# EAGLE design sub_module (EAGLE 7.5.0)
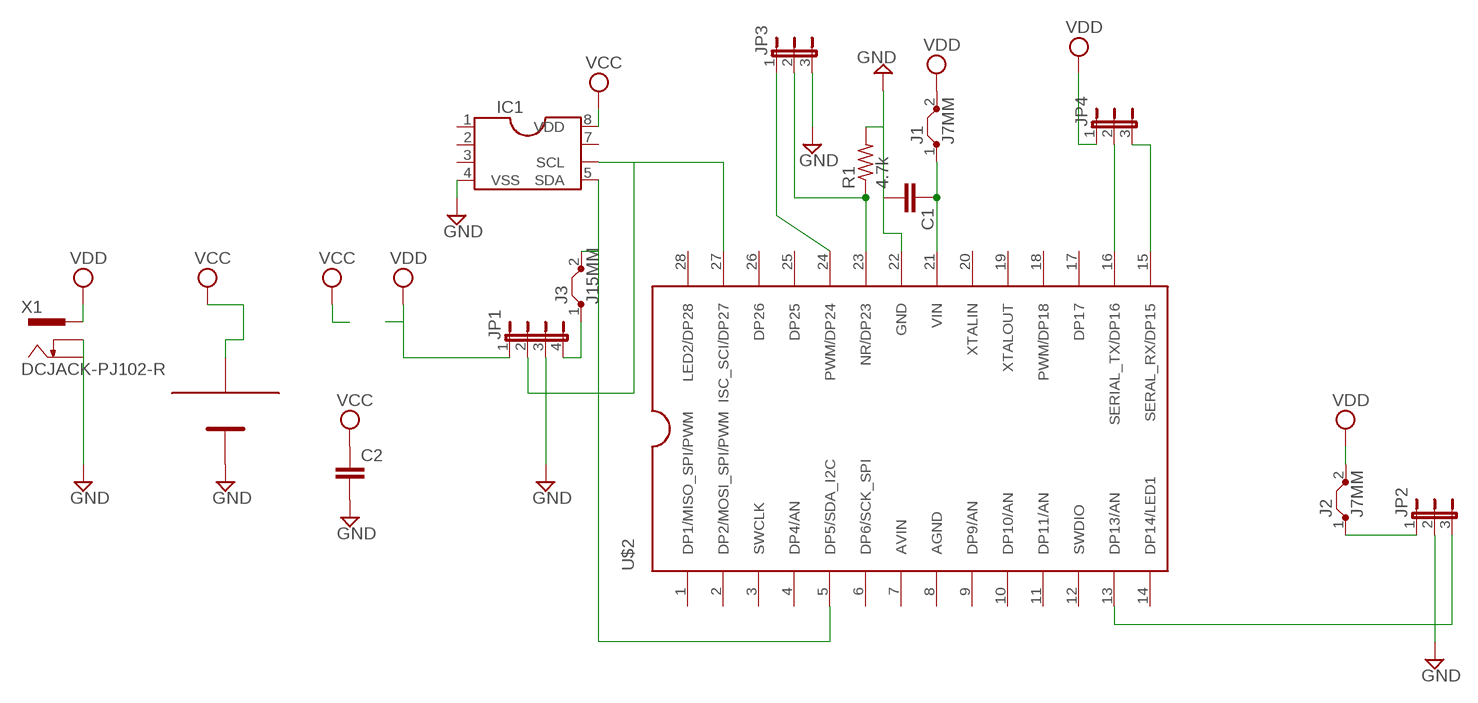
[diagram p0: schematic, sheet 1]

## Parts
C1  C-EUC2012  [C2012]
C2  C-EUC2012  [C2012]
IC1  DIL8S  [SOCKET-08]
J1  J7MM  [07]
J2  J7MM  [07]
J3  J15MM  [15]
JP1  JP4E  [JP4]
JP2  JP2E  [JP2]
JP3  JP2E  [JP2]
JP4  JP2E  [JP2]
R1  4.7k  R-US_0207/2V  [0207/2V]
U$1  CR2032-HOLDER2  [CR2032-HOLDER2]
U$2  LPC1114FDH28  [TSSOP28]
X1  DCJACK-PJ102-R  [PJ-102-R]

## Nets
GND: C1.2 C2.2 IC1.4(VSS) JP1.3 JP2.2 JP3.3 R1.2 U$1.GND U$2.22(GND) X1.2 X1.3
N$1: IC1.6(SCL) JP1.2 U$2.27(ISC_SCI/DP27)
N$2: IC1.5(SDA) J3.2 U$2.5(DP5/SDA_I2C)
N$3: C1.1 J1.1 U$2.21(VIN)
N$4: JP4.3 U$2.15(SERAL_RX/DP15)
N$5: J2.1 JP2.1
N$6: JP2.3 U$2.13(DP13/AN)
N$7: JP4.2 U$2.16(SERIAL_TX/DP16)
N$8: J3.1 JP1.4
N$9: JP3.2 R1.1 U$2.23(NR/DP23)
N$10: JP3.1 U$2.24(PWM/DP24)
VCC: C2.1 IC1.8(VDD) U$1.+3V
VDD: J1.2 J2.2 JP1.1 JP4.1 X1.1
Unconnected: IC1.1(CLKOE) IC1.2(CLKOUT) IC1.3(INT) IC1.7(V.C.) U$2.1(DP1/MISO_SPI/PWM) U$2.2(DP2/MOSI_SPI/PWM) U$2.3(SWCLK) U$2.4(DP4/AN) U$2.6(DP6/SCK_SPI) U$2.9(DP9/AN) U$2.10(DP10/AN) U$2.11(DP11/AN) U$2.12(SWDIO) U$2.14(DP14/LED1) U$2.17(DP17) U$2.18(PWM/DP18) U$2.19(XTALOUT) U$2.20(XTALIN) U$2.25(DP25) U$2.26(DP26) U$2.28(LED2/DP28)

## Power pins joined to a net without a drawn wire
AGND: U$2.8(AGND)
AVIN: U$2.7(AVIN)

## Library data of the parts
C1 C2 = rcl:C-EU: CAPACITOR, European symbol
IC1 = RTC-module:DIL8: Dual In Line / Socket
J1-J3 = jumper:J: Bridge
JP1 = jumper:JP4E: JUMPER
JP2-JP4 = jumper:JP2E: JUMPER
R1 = rcl:R-US_: RESISTOR, American symbol
U$1 = CR2032-holder:CR2032-HOLDER2
U$2 = lpc1114fn28:LPC1114FDH28
X1 = dcjack:DCJACK: DC JACK 2.1mmφ - 5.5mmφ DCジャック、基板用。

## Board
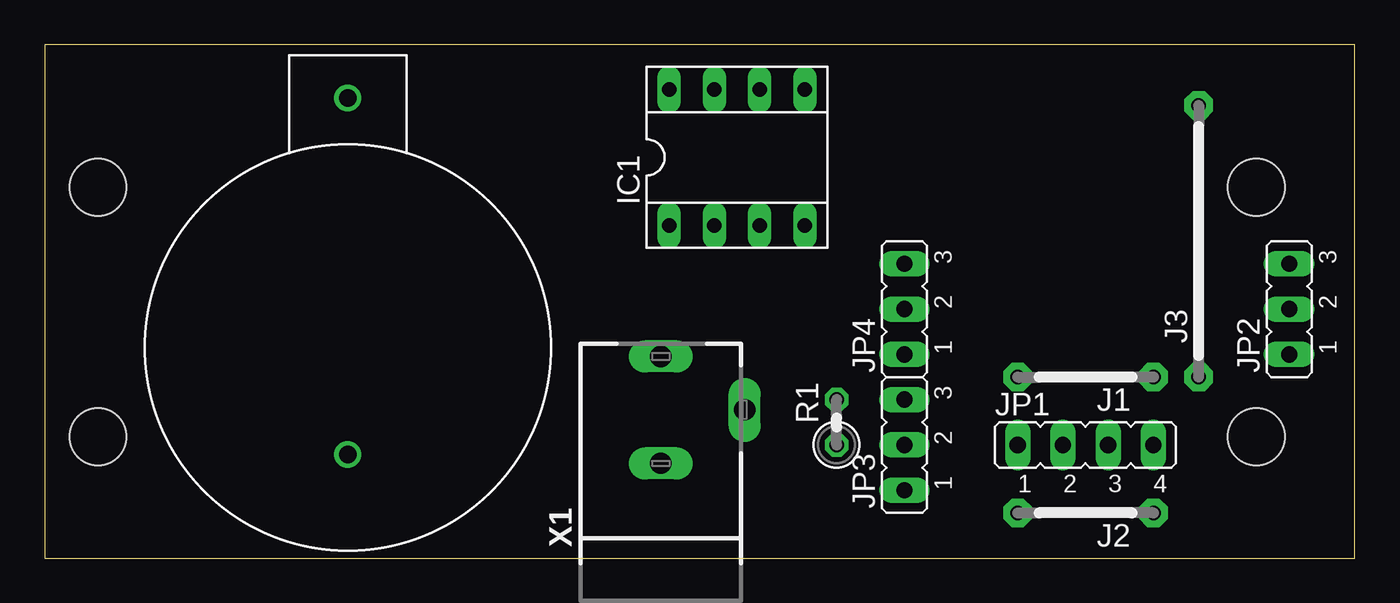
[diagram p1: board, top side]
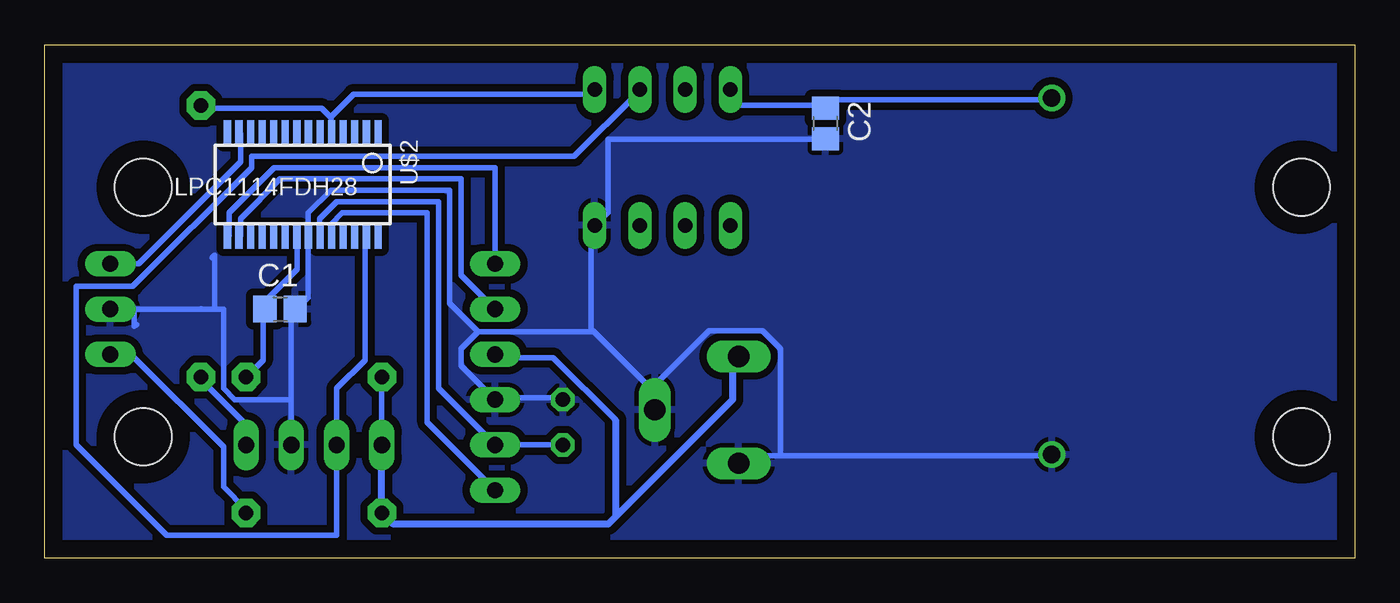
[diagram p2: board, bottom side, seen from below]

Size 73.54 x 28.81 mm. Coordinates in mm from the lower left corner, seen from the top.
Outline: 0,0 73.54,0 73.54,28.81 0,28.81 0,0
Copper layers (1*16): Top 0.035mm / dielectric 1.5mm / Bottom 0.035mm
Design rules "default *": minimum track width 0.3mm, minimum drill 24mil, track to track 0.2mm, track to pad 0.2mm, pad to pad 0.2mm, via to via 0.2mm, smd to smd 8mil, copper to edge 40mil, drill to drill 8mil, minimum pad ring 10mil, minimum via ring 8mil, stop-mask expansion 4mil, vias tented up to drill 0mil, thermal gap 10mil
Holes 3.2 mm at 3,6.81 68,20.81 3,20.81 68,6.81

### Footprints (pad centres in the part's own frame; a part is rotated, then mirrored left to right if it is on the bottom)
C2012 = smd 1.3 x 1.5: 1 -0.85,0; 2 0.85,0
SOCKET-08 = drill 0.813 long: 1 -3.81,-3.81; 2 -1.27,-3.81; 3 1.27,-3.81; 4 3.81,-3.81; 5 3.81,3.81; 6 1.27,3.81; 7 -1.27,3.81; 8 -3.81,3.81
07 = drill 0.813 pad 1.6 octagon: 1 -3.81,0; 2 3.81,0
15 = drill 0.813 pad 1.6 octagon: 1 -7.62,0; 2 7.62,0
JP4 = drill 0.914 long: 1 -3.81,0; 2 -1.27,0; 3 1.27,0; 4 3.81,0
JP2 = drill 0.914 long: 1 -2.54,0; 2 0,0; 3 2.54,0
0207/2V = drill 0.813 octagon: 1 -1.27,0; 2 1.27,0
CR2032-HOLDER2 = drill 1: +3V 0,-14; GND 0,6
TSSOP28 = smd 0.4 x 1.35: 1 -4.225,-2.925; 2 -3.575,-2.925; 3 -2.925,-2.925; 4 -2.275,-2.925; 5 -1.625,-2.925; 6 -0.975,-2.925; 7 -0.325,-2.925; 8 0.325,-2.925; 9 0.975,-2.925; 10 1.625,-2.925; 11 2.275,-2.925; 12 2.925,-2.925; 13 3.575,-2.925; 14 4.225,-2.925; 15 4.225,2.925; 16 3.575,2.925; 17 2.925,2.925; 18 2.275,2.925; 19 1.625,2.925; 20 0.975,2.925; 21 0.325,2.925; 22 -0.325,2.925; 23 -0.975,2.925; 24 -1.625,2.925; 25 -2.275,2.925; 26 -2.925,2.925; 27 -3.575,2.925; 28 -4.225,2.925
PJ-102-R = drill 1.2 pad 1.8 long: 1 3.7,0; 2 -2.3,0; 3 0.7,-4.7

### Placement (x,y rotation side)
C1  60.33,13.97 0 bottom
C2  29.72,24.38 270 bottom
IC1  38.86,22.48 0 top
J1  58.42,10.16 180 top
J2  58.42,2.54 180 top
J3  64.77,17.78 90 top
JP1  58.42,6.35 0 top
JP2  69.85,13.97 90 top
JP3  48.26,6.35 90 top
JP4  48.26,13.97 90 top
R1  44.45,7.62 90 top
U$1  17.02,11.81 180 top
U$2  59.05,20.95 180 bottom
X1  34.59,7.62 90 top

### Tracks (layer width: path | path; a pad name or v marks a point on that pad's centre or on a via)
GND
  Bottom 0.3: 59.69,8.89 59.69,13.97 C1.2 59.37,13.97 58.74,14.61 58.74,17.78 U$2.22 58.74,18.1 58.74,19.37 57.47,20.64 50.8,20.64 50.8,14.29 49.21,12.7 | 59.69,8.89 JP1.3 | 64,13.97 63.5,13.97 63.5,9.53 62.87,8.89 59.69,8.89 | 64,13.97 64.75,13.97 | 64.75,13.97 JP2.2 68.5,14 68.5,13 68.38,13.08 | C2.2 29.84,23.5 41.91,23.5 41.91,19.37 42.55,18.73 IC1.4 42.86,18.41 42.86,12.75 | 49.21,12.7 50.16,11.75 50.16,10.79 JP3.3 48.25,9 44.5,9 R1.2 | 49.21,12.7 42.86,12.7 42.86,12.75 | 64.75,14 64.75,13.97 | 64.14,16.86 64,17 64,13.97 | 32.25,5.75 34.25,5.75 34.5,5.5 X1.2 | 32.25,5.75 17.25,5.75 U$1.GND | 39.5,9.5 39.5,8.5 X1.3 39.5,9.5 | 39.5,9.5 42.75,12.75 42.86,12.75 | 32.25,5.75 32.25,11.75 33.25,12.75 36.25,12.75 39.5,9.5
  pour Bottom (isolate 0.406): 0,28.57 73.66,28.57 73.66,0 0,0
N$1
  Bottom 0.3: U$2.27 55.56,17.78 55.56,11.11 57.15,9.53 JP1.2 57.15,1.27 66.67,1.27 71.75,6.35 71.75,15.24 68.58,15.24 61.91,21.91 61.91,22.54 43.81,22.54 40.32,26.04 IC1.6
N$2
  Bottom 0.3: 57.47,24.77 57.47,24.13 U$2.5 | 57.47,24.77 56.2,26.04 42.86,26.04 IC1.5 | J3.2 64.75,25.25 58,25.25 57.5,24.75 57.47,24.77
N$3
  Bottom 0.3: U$2.21 59.37,17.78 59.37,16.19 60.96,14.61 60.96,13.97 C1.1 61.28,13.97 61.28,11.11 J1.1
N$4
  Bottom 0.3: JP4.3 48.26,21.91 60.64,21.91 63.18,19.37 63.18,18.1 U$2.15
N$5
  Bottom 0.3: JP2.1 69.75,11.25 68.5,11.25 63.5,6.25 63.5,4 62.25,2.75 J2.1
N$6
  Bottom 0.3: JP2.3 68.26,16.51 62.55,22.23 62.55,23.81 U$2.13
N$7
  Bottom 0.3: JP4.2 50.16,15.88 50.16,21.27 60.33,21.27 62.55,19.05 62.55,18.1 U$2.16
N$8
  Bottom 0.3: JP1.4 62.25,6.5 62.25,7.5 64.75,10 J3.1
N$9
  Bottom 0.3: U$2.23 58.1,18.1 58.1,19.05 57.15,20 51.44,20 51.44,9.53 JP3.2 R1.1
N$10
  Bottom 0.3: JP3.1 52.07,7.62 52.07,19.37 56.83,19.37 57.47,18.73 57.47,18.1 U$2.24
VCC
  Bottom 0.3: IC1.8 34.92,26.04 34.92,25.4 29.84,25.4 C2.1 29.53,25.4 29.53,25.72 17.14,25.72 U$1.+3V
VDD
  Bottom 0.3: J1.2 JP1.1 | 41.5,7.75 45,11.25 48.25,11.25 JP4.1 | 34.75,11.25 X1.1 | 54.5,2.5 J2.2
  Bottom 0.406: 34.75,11.25 34.92,11.07 34.92,8.89 41.5,2.31 | 41.5,2.31 41.91,1.91 53.98,1.91 J2.2 JP1.1 | 41.5,7.75 41.5,2.31